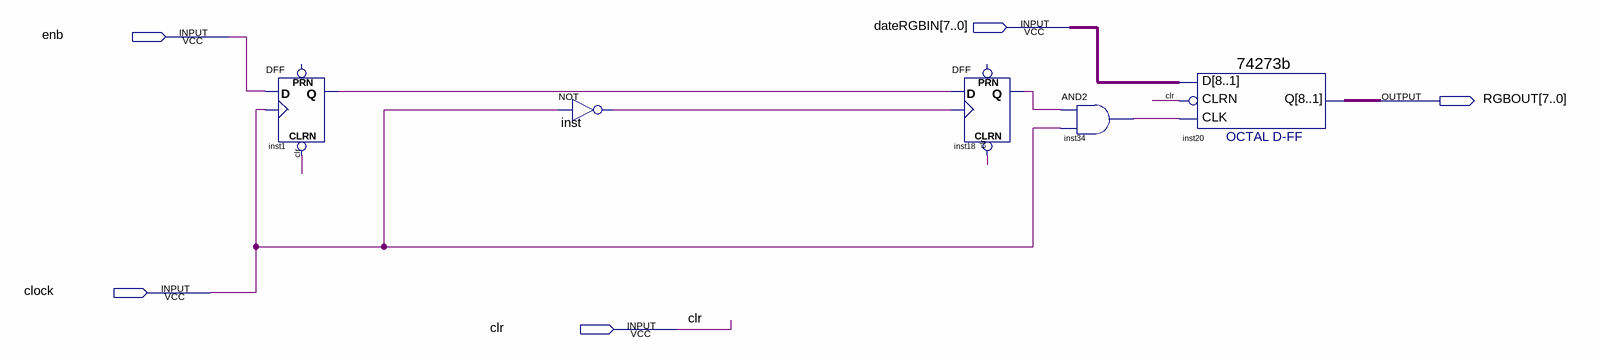
[diagram p0: schematic sheet]
// Quartus schematic rgboutPUT.bdf as structural Verilog: 5 symbols, 5 pins
module rgboutPUT (
  input  [7:0] dateRGBIN,
  input  enb,
  input  clock,
  input  clr,
  output [7:0] RGBOUT
);

  wire inst1_q, inst18_q, inst34_out, inst_out;

  DFF inst1 (.CLRN(clr), .CLK(clock), .D(enb), .Q(inst1_q));  // open: PRN
  not inst (inst_out, clock);
  DFF inst18 (.CLRN(clr), .CLK(inst_out), .D(inst1_q), .Q(inst18_q));  // open: PRN
  and inst34 (inst34_out, inst18_q, clock);
  \74273b  inst20 (.CLK(inst34_out), .D(dateRGBIN), .CLRN(clr), .Q(RGBOUT));
endmodule
